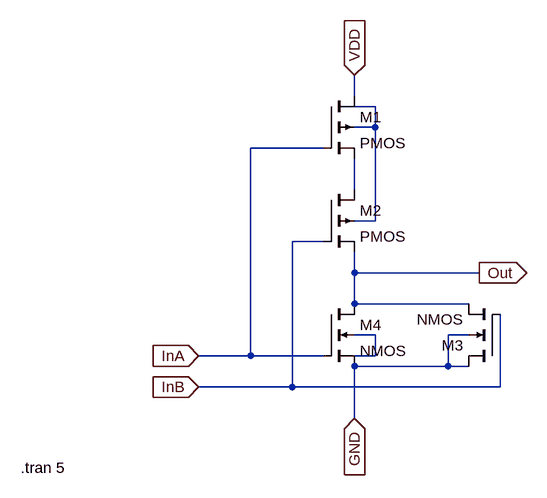
[diagram p0: schematic NOR.asc]
NOR.asc, the LTspice schematic file:
Version 4
SHEET 1 880 704
WIRE 224 96 224 64
WIRE 256 112 224 112
WIRE 256 144 256 112
WIRE 256 144 224 144
WIRE 176 176 64 176
WIRE 224 240 224 192
WIRE 256 288 256 144
WIRE 256 288 224 288
WIRE 176 320 128 320
WIRE 224 368 224 336
WIRE 416 368 224 368
WIRE 224 416 224 368
WIRE 400 416 224 416
WIRE 224 432 224 416
WIRE 256 464 224 464
WIRE 400 464 368 464
WIRE 64 496 64 176
WIRE 64 496 -16 496
WIRE 176 496 64 496
WIRE 256 496 256 464
WIRE 256 496 224 496
WIRE 368 512 368 464
WIRE 368 512 224 512
WIRE 400 512 368 512
WIRE 128 544 128 320
WIRE 128 544 -16 544
WIRE 448 544 448 432
WIRE 448 544 128 544
WIRE 224 592 224 512
FLAG 416 368 Out
IOPIN 416 368 Out
FLAG -16 496 InA
IOPIN -16 496 In
FLAG -16 544 InB
IOPIN -16 544 In
FLAG 224 64 VDD
IOPIN 224 64 In
FLAG 224 592 GND
IOPIN 224 592 In
SYMBOL pmos4 176 96 R0
SYMATTR InstName M1
SYMBOL pmos4 176 240 R0
SYMATTR InstName M2
SYMBOL nmos4 176 416 R0
SYMATTR InstName M4
SYMBOL nmos4 448 512 R180
SYMATTR InstName M3
TEXT -290 668 Left 2 !.tran 5

The netlist it stands for:
* NOR.asc
M1 VDD InA N002 N001 PMOS
M2 N002 InB Out N001 PMOS
M4 Out InA GND N003 NMOS
M3 GND InB Out GND NMOS
.model NMOS NMOS
.model PMOS PMOS
.lib standard.mos
.tran 5
.backanno
.end